# EAGLE design design (EAGLE 9.6.2)
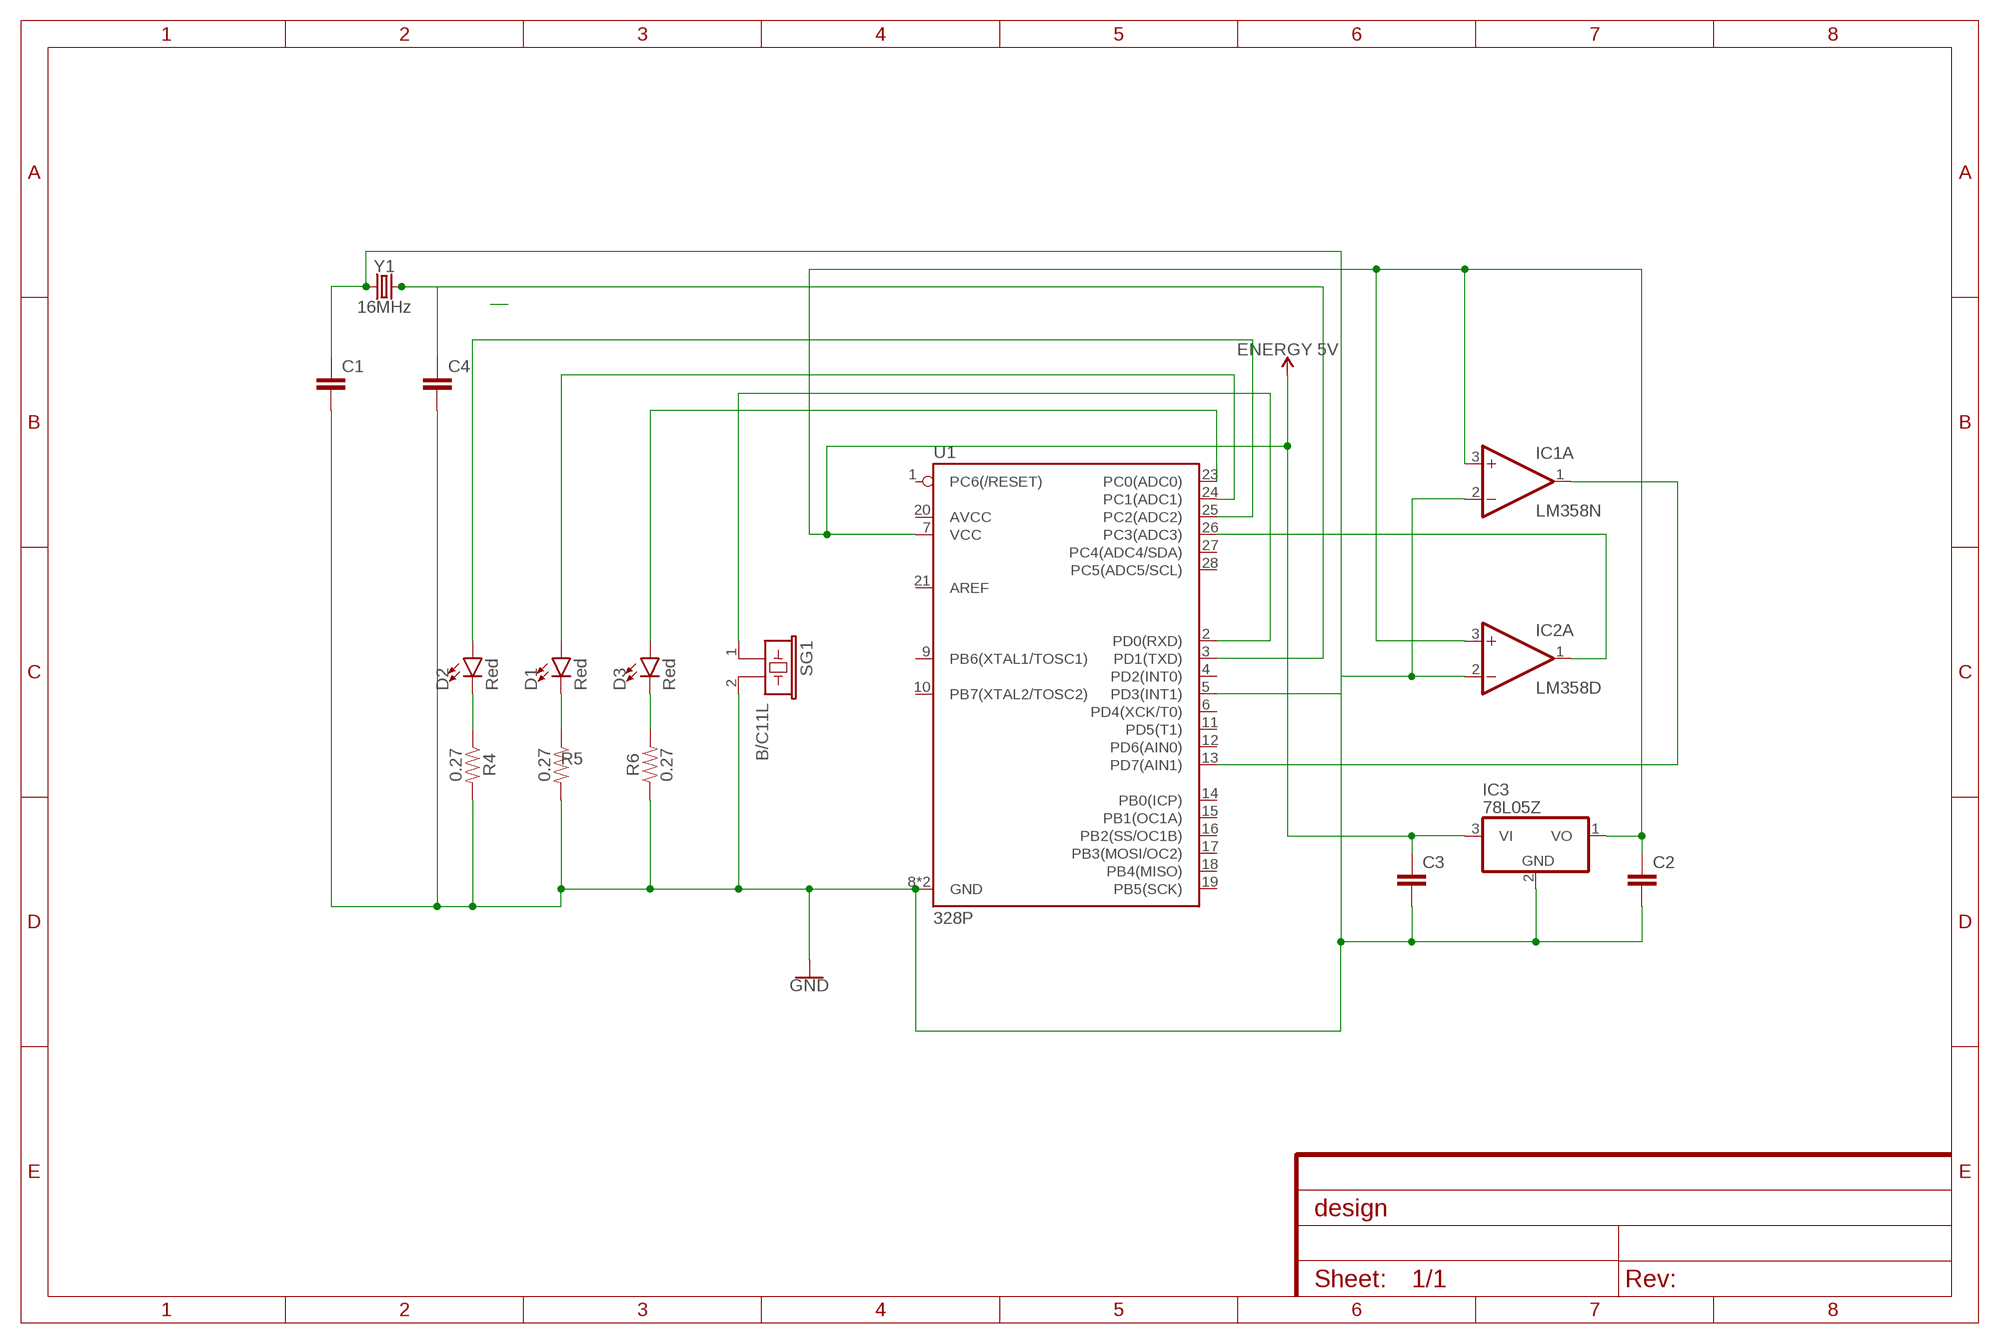
[diagram p0: schematic, sheet 1]

## Parts
C1  C2,5-3  [C2.5-3]
C2  C2,5-3  [C2.5-3]
C3  C2,5-3  [C2.5-3]
C4  C2,5-3  [C2.5-3]
D1  Red  LED-RED-0603-WE  [LED-0603]
D2  Red  LED-RED-0603-WE  [LED-0603]
D3  Red  LED-RED-0603-WE  [LED-0603]
IC1  LM358N  [DIL08]
IC2  LM358D  [SO08]
IC3  78L05Z  [TO92]
R4  0.27  0.27OHM-0603-1/10W-1%  [0603]
R5  0.27  0.27OHM-0603-1/10W-1%  [0603]
R6  0.27  0.27OHM-0603-1/10W-1%  [0603]
SG1  B/C11L  [B/C11L]
U1  328P  ATMEGA328P_PDIP  [DIP28]
Y1  16MHz  CRYSTAL-16MHZPTH-HC49US  [HC49US]

## Nets
GND: C1.2 C2.2 C3.2 C4.2 IC1.2(A:-IN) IC2.2(A:-IN) IC3.2(GND) R4.2 R5.2 R6.1 SG1.2 U1.8(GND) U1.22(GND)
N$2: IC2.1(A:OUT) U1.26(PC3(ADC3))
N$3: D2.C R4.1
N$4: D1.C R5.1
N$5: D3.C R6.2
N$6: D2.A U1.25(PC2(ADC2))
N$8: D3.A U1.23(PC0(ADC0))
N$9: D1.A U1.24(PC1(ADC1))
N$10: SG1.1 U1.2(PD0(RXD))
N$11: C4.1 U1.3(PD1(TXD)) Y1.2
N$12: C1.1 U1.5(PD3(INT1)) Y1.1
N$13: IC1.1(A:OUT) U1.13(PD7(AIN1))
V_BATT: C2.1 C3.1 IC1.3(A:+IN) IC2.3(A:+IN) IC3.1(VO) IC3.3(VI) U1.7(VCC) ; supply symbol labelled ENERGY 5V
Unconnected: IC1.5(B:+IN) IC1.6(B:-IN) IC1.7(B:OUT) IC2.5(B:+IN) IC2.6(B:-IN) IC2.7(B:OUT) U1.1(PC6(/RESET)) U1.4(PD2(INT0)) U1.6(PD4(XCK/T0)) U1.9(PB6(XTAL1/TOSC1)) U1.10(PB7(XTAL2/TOSC2)) U1.11(PD5(T1)) U1.12(PD6(AIN0)) U1.14(PB0(ICP)) U1.15(PB1(OC1A)) U1.16(PB2(SS/OC1B)) U1.17(PB3(MOSI/OC2)) U1.18(PB4(MISO)) U1.19(PB5(SCK)) U1.20(AVCC) U1.21(AREF) U1.27(PC4(ADC4/SDA)) U1.28(PC5(ADC5/SCL))

## Power pins joined to a net without a drawn wire
V+: IC1.8(P:V+) IC2.8(P:V+)
V-: IC1.4(P:V-) IC2.4(P:V-)

## Library data of the parts
C1-C4 = capacitor-wima:C: CAPACITOR naming: grid - package width
D1-D3 = SparkFun-LED:LED-RED: Red SMD LED Used in manufacturing of most products at SparkFun Packages: 0603 - KB - KingBright (DIO-17976) SMD 0603 package [Datasheet] <https://www.kingbrightusa.com/images/catalog/SPEC/APT1608SURCK.pdf> 0603 - (DIO-00819, has gone EOL) SMD 0603 package 0603 SMART - SMD 0603 SMART package ( more efficient and expensive)[Product Link] <http://www.osram-os.com/Graphics/XPic2/00077099_0.pdf> 1206 - SMD1206 package [Product Link] <https://www.sparkfun.com/datasheets/DevTools/LilyPad/Q150OVS4.pdff> SparkFun Products: Pro Mini 328 -5V <https://www.sparkfun.com/products/821> RedBoard <https://www.sparkfun.com/products/12757> IOIO-OTG <https://www.sparkfun.com/products/13613>; PROD_ID: DIO-16511
IC1 IC2 = linear:LM358: OP AMP also LM158; LM258; LM2904 Source: http://cache.national.com/ds/LM/LM158.pdf
IC3 = linear:78*: Positive VOLTAGE REGULATOR Source: http://cache.national.com/ds/LM/LM78L05.pdf http://www.fairchildsemi.com/ds/LM/LM7805.pdf
R4-R6 = SparkFun-Resistors:0.27OHM: 0.27Ω resistor A resistor is a passive two-terminal electrical component that implements electrical resistance as a circuit element. Resistors act to reduce current flow, and, at the same time, act to lower voltage levels within circuits. - Wikipedia; PROD_ID: RES-08787
SG1 = buzzer:B/C11L: BUZZER Source: Buerklin; OC_FARNELL: unknown; OC_NEWARK: unknown
U1 = SparkFun-IC-Microcontroller:ATMEGA328P_PDIP: Atmel 328P Through hole ATMEGA328P uC used in the Arduino 32kb flash, 1k EEPROM, 2k SRAM Datasheet <http://www.sparkfun.com/datasheets/Components/SMD/ATMega328.pdf> SparkFun Products Storefront component: AVR 28 Pin 20MHz 32K 6A/D - ATMega328P <https://www.sparkfun.com/products/9061> (COM-09061) SparkFun Simon Says - Through-Hole Soldering Kit <https://www.sparkfun.com/products/10547> (KIT-10547) SparkFun Learn to Solder - Simon Says <https://www.sparkfun.com/products/13708> (KIT-13708) SparkFun BigTime Watch Kit <https://www.sparkfun.com/products/11734> (KIT-11734) SparkFun ClockIt <https://www.sparkfun.com/products/10930> (KIT-10930) SparkFun Serial Enabled LCD Kit <https://www.sparkfun.com/products/10097> (LCD-10097) SparkFun Simon Tilts - Through Hole Soldering Kit <https://www.sparkfun.com/products/12634> (KIT-12634) SparkFun Frequency Counter Kit <https://www.sparkfun.com/products/10140> (KIT-10140) FabFM Radio Kit <https://www.sparkfun.com/products/11043> (KIT-11043) SparkFun Binary Blaster Kit <https://www.sparkfun.com/products/12037> (KIT-12037) SparkFun Metro-Gnome <https://www.sparkfun.com/products/9236> (KIT-09236) ATmega328 with Arduino Optiboot (Uno) <https://www.sparkfun.com/products/10524> (DEV-10524); PROD_ID: IC-09136
Y1 = SparkFun-Clocks:CRYSTAL-16MHZ: 16MHz Crystal Digikey Example <http://www.digikey.com/product-search/en?keywords=535-9122-1-ND> Frequency: 16MHz Frequency Stability: ±50ppm Frequency Tolerance: ±20ppm Load Capacitance: 18pF SparkFun Products: Pro Micro -5V/16MHz <https://www.sparkfun.com/products/12640> SparkFun Serial Enabled LCD Kit <https://www.sparkfun.com/products/10097>; PROD_ID: XTAL-08181; SF_ID: COM-00536

## Board
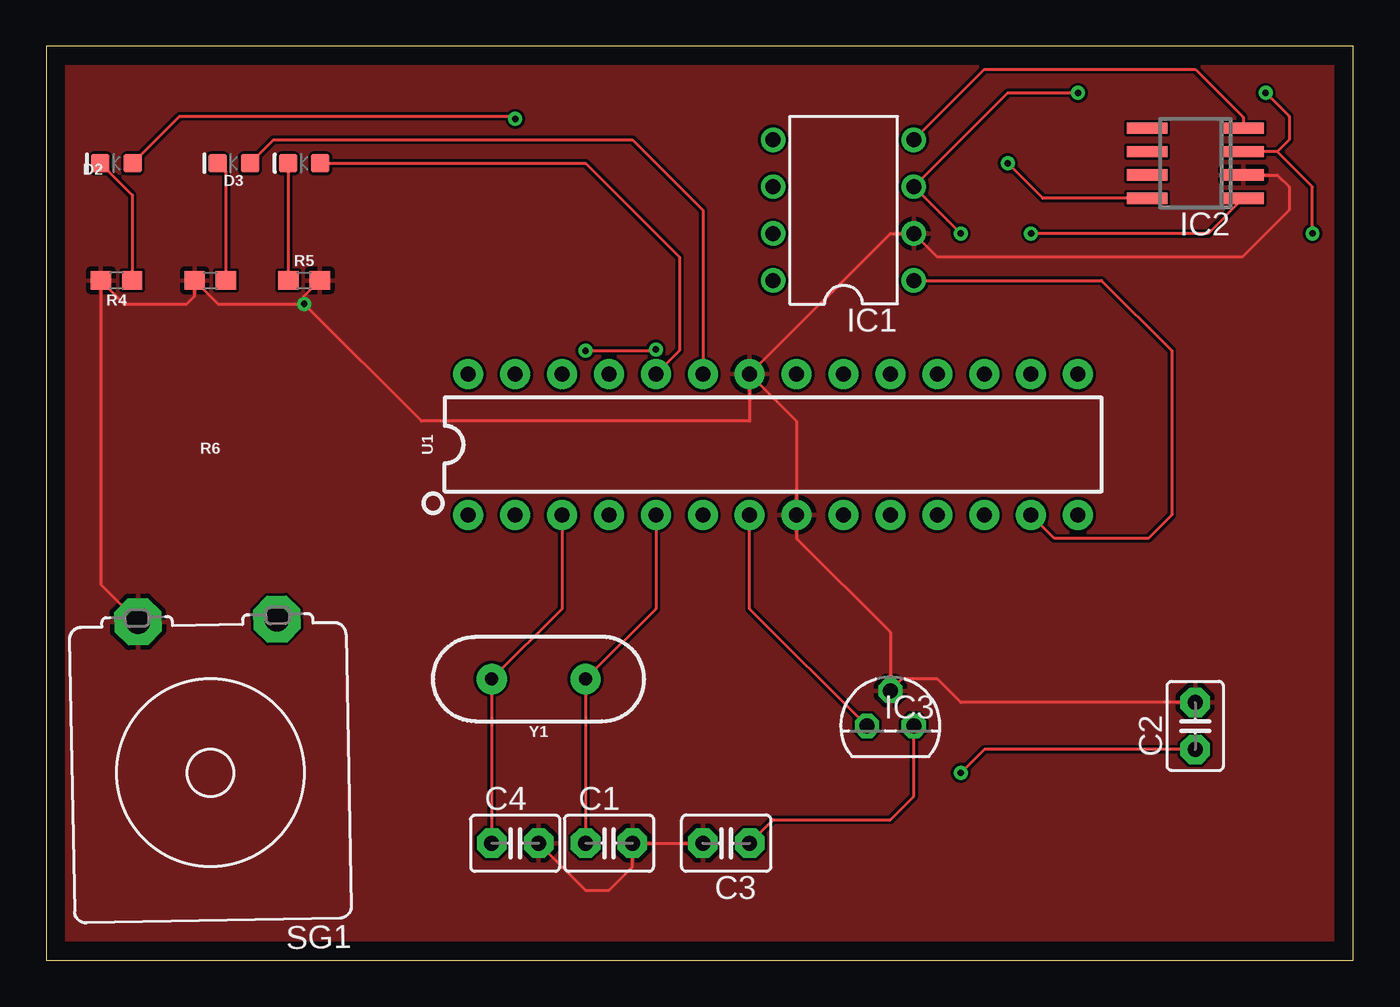
[diagram p1: board, top side]
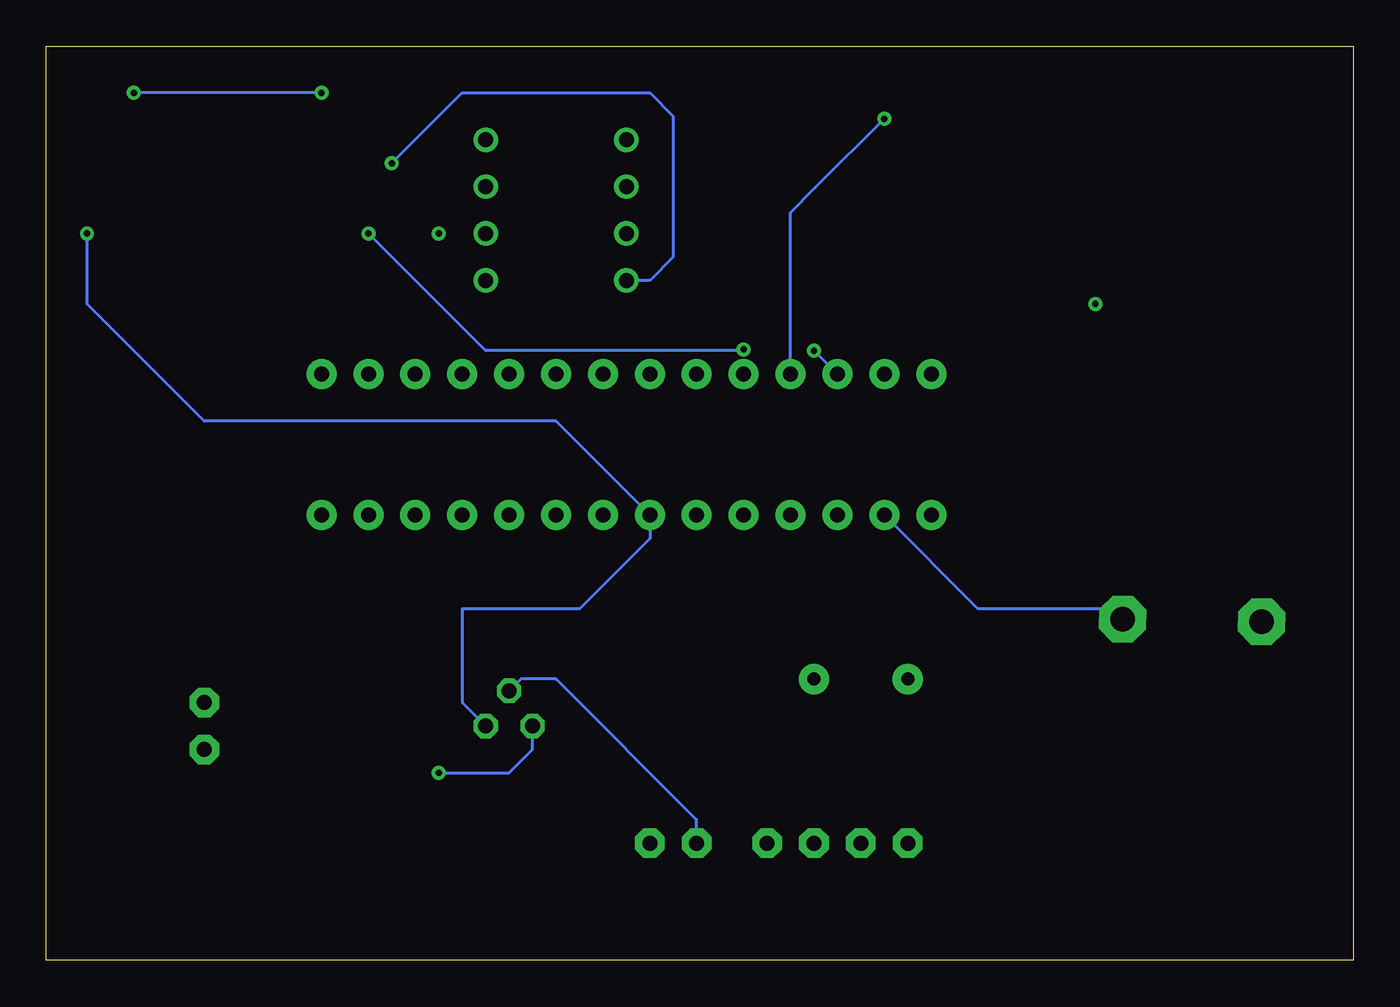
[diagram p2: board, bottom side, seen from below]

Size 70.79 x 49.52 mm. Coordinates in mm from the lower left corner, seen from the top.
Outline: 0,0 70.79,0 70.79,49.52 0,49.52 0,0
Copper layers (1*16): Top 0.035mm / dielectric 1.5mm / Bottom 0.035mm
Design rules "default": minimum track width 6mil, minimum drill 0.35mm, track to track 6mil, track to pad 6mil, pad to pad 6mil, via to via 6mil, smd to smd 6mil, copper to edge 40mil, drill to drill 6mil, minimum pad ring 10mil, minimum via ring 8mil, stop-mask expansion 4mil, vias tented up to drill 0mil, thermal gap 10mil

### Footprints (pad centres in the part's own frame; a part is rotated, then mirrored left to right if it is on the bottom)
C2.5-3 = drill 0.813 pad 1.6 octagon: 1 -1.27,0; 2 1.27,0
LED-0603 = smd 1 x 1: A -0.877,0; C 0.877,0
DIL08 = drill 0.813 pad 1.27: 1 -3.81,-3.81; 2 -1.27,-3.81; 3 1.27,-3.81; 4 3.81,-3.81; 5 3.81,3.81; 6 1.27,3.81; 7 -1.27,3.81; 8 -3.81,3.81
SO08 = smd 0.6 x 2.2: 1 -1.905,-2.6; 2 -0.635,-2.6; 3 0.635,-2.6; 4 1.905,-2.6; 5 1.905,2.6; 6 0.635,2.6; 7 -0.635,2.6; 8 -1.905,2.6
TO92 = drill 0.813 octagon: 1 -1.27,0; 2 0,1.905; 3 1.27,0
0603 = smd 1.1 x 1: 1 -0.85,0; 2 0.85,0
B/C11L = drill 1.321 pad 2.54 octagon: 1 -3.759,-8.255; 2 3.759,-8.255
DIP28 = drill 0.813 pad 1.626: 1 -16.51,-3.81; 2 -13.97,-3.81; 3 -11.43,-3.81; 4 -8.89,-3.81; 5 -6.35,-3.81; 6 -3.81,-3.81; 7 -1.27,-3.81; 8 1.27,-3.81; 9 3.81,-3.81; 10 6.35,-3.81; 11 8.89,-3.81; 12 11.43,-3.81; 13 13.97,-3.81; 14 16.51,-3.81; 15 16.51,3.81; 16 13.97,3.81; 17 11.43,3.81; 18 8.89,3.81; 19 6.35,3.81; 20 3.81,3.81; 21 1.27,3.81; 22 -1.27,3.81; 23 -3.81,3.81; 24 -6.35,3.81; 25 -8.89,3.81; 26 -11.43,3.81; 27 -13.97,3.81; 28 -16.51,3.81
HC49US = drill 0.7 pad 1.651: 1 -2.54,0; 2 2.54,0

### Placement (x,y rotation side)
C1  30.48,6.35 0 top
C2  62.23,12.7 90 top
C3  36.83,6.35 180 top
C4  25.4,6.35 0 top
D1  13.97,43.18 180 top
D2  3.81,43.18 180 top
D3  10.16,43.18 180 top
IC1  43.18,40.64 90 top
IC2  62.23,43.18 90 top
IC3  45.72,12.7 0 top
R4  3.81,36.83 180 top
R5  13.97,36.83 0 top
R6  8.89,36.83 0 top
SG1  8.89,10.16 181.1 top
U1  39.37,27.94 0 top
Y1  26.67,15.24 180 top

### Tracks (layer width: path | path; a pad name or v marks a point on that pad's centre or on a via)
GND  (via drill 0.35)
  Top 0.152: v13.97,35.56 9.31,35.56 R6.1 8.04,35.98 7.62,35.56 4.23,35.56 R4.2 2.96,20.35 SG1.2 | 14.82,36.41 R5.2 13.97,35.98 v13.97,35.56 | U1.22 38.1,29.21 20.32,29.21 v13.97,35.56 | C4.2 29.21,3.81 30.48,3.81 31.75,5.08 C1.2 C3.2 | C2.2 49.53,13.97 48.26,15.24 46.36,15.24 IC3.2 45.72,17.78 40.64,22.86 U1.8 40.64,29.21 U1.22 | IC2.2 66.67,42.54 67.31,41.91 67.31,40.64 64.77,38.1 48.26,38.1 IC1.2 45.72,39.37 U1.22
  Bottom 0.152: C3.2 35.56,7.62 43.18,15.24 45.08,15.24 IC3.2
  pour Top: 0,49.53 0,0 71.12,0 71.12,49.53
N$2  (via drill 0.35)
  Top 0.152: IC2.1 62.92,39.37 v53.34,39.37 | v29.21,33.02 33.02,33.02 v33.02,33.09
  Bottom 0.152: v53.34,39.37 46.99,33.02 33.09,33.02 v33.02,33.09 | U1.26 v29.21,33.02
N$3
  Top 0.152: D2.C 4.66,41.45 R4.1
N$4
  Top 0.152: D1.C 13.09,36.86 R5.1
N$5
  Top 0.152: R6.2 9.74,42.72 D3.C
N$6  (via drill 0.35)
  Top 0.152: D2.A 7.23,45.72 25.4,45.72 v25.4,45.59
  Bottom 0.152: v25.4,45.59 29.14,41.84 30.48,40.51 U1.25
N$8
  Top 0.152: D3.A 12.31,44.45 31.75,44.45 35.56,40.64 U1.23
N$9
  Top 0.152: D1.A 29.21,43.18 34.29,38.1 34.29,33.02 U1.24
N$10
  Top 0.152: SG1.1 13.41,18.49
  Bottom 0.152: SG1.1 13.05,19.05 20.32,19.05 U1.2
N$11
  Top 0.152: C4.1 Y1.2 27.94,19.05 U1.3
N$12
  Top 0.152: C1.1 Y1.1 33.02,19.05 U1.5
N$13
  Top 0.152: IC1.1 57.15,36.83 60.96,33.02 60.96,24.13 59.69,22.86 54.61,22.86 U1.13
V+  (via drill 0.35)
  Top 0.152: IC2.8 53.97,41.27 v52.07,43.18
  Bottom 0.152: v52.07,43.18 48.26,46.99 38.1,46.99 36.83,45.72 36.83,38.1 38.1,36.83 IC1.8
V-
  Top 0.152: IC1.4 50.8,48.26 62.23,48.26 64.83,45.66 IC2.4
V_BATT  (via drill 0.35)
  Top 0.152: C3.1 39.37,7.62 45.72,7.62 46.99,8.89 IC3.3 | C2.1 50.8,11.43 v49.53,10.16 | IC3.1 38.1,19.05 U1.7 | v55.88,46.99 52.07,46.99 IC1.3 v49.53,39.37 | v66.04,46.99 67.31,45.72 67.31,44.45 66.67,43.81 | 66.67,43.81 IC2.3 | v68.58,39.37 68.58,41.91 66.67,43.81
  Bottom 0.152: v49.53,10.16 45.72,10.16 44.45,11.43 IC3.1 | v55.88,46.99 v66.04,46.99 | IC3.3 48.26,13.97 48.26,19.05 41.91,19.05 38.1,22.86 U1.7 43.18,29.21 62.23,29.21 68.58,35.56 v68.58,39.37